# EAGLE design emrom (EAGLE 5.10)
COPYRIGHT: 202|238|226|224|240; DESCRIPTION_1: 209|245|229|236|224|32|253|235|229|234|242|240|232|247|229|241|234|224|255; DESCRIPTION_2: 239|240|232|237|232|246|232|239|232|224|235|252|237|224|255; DESCRIPTION_3: 253|236|243|235|255|242|238|240|224|32|207|199|211; NUMBER: 213|213|213|46|48|48|48|46|48|48|48|46|48|48|48
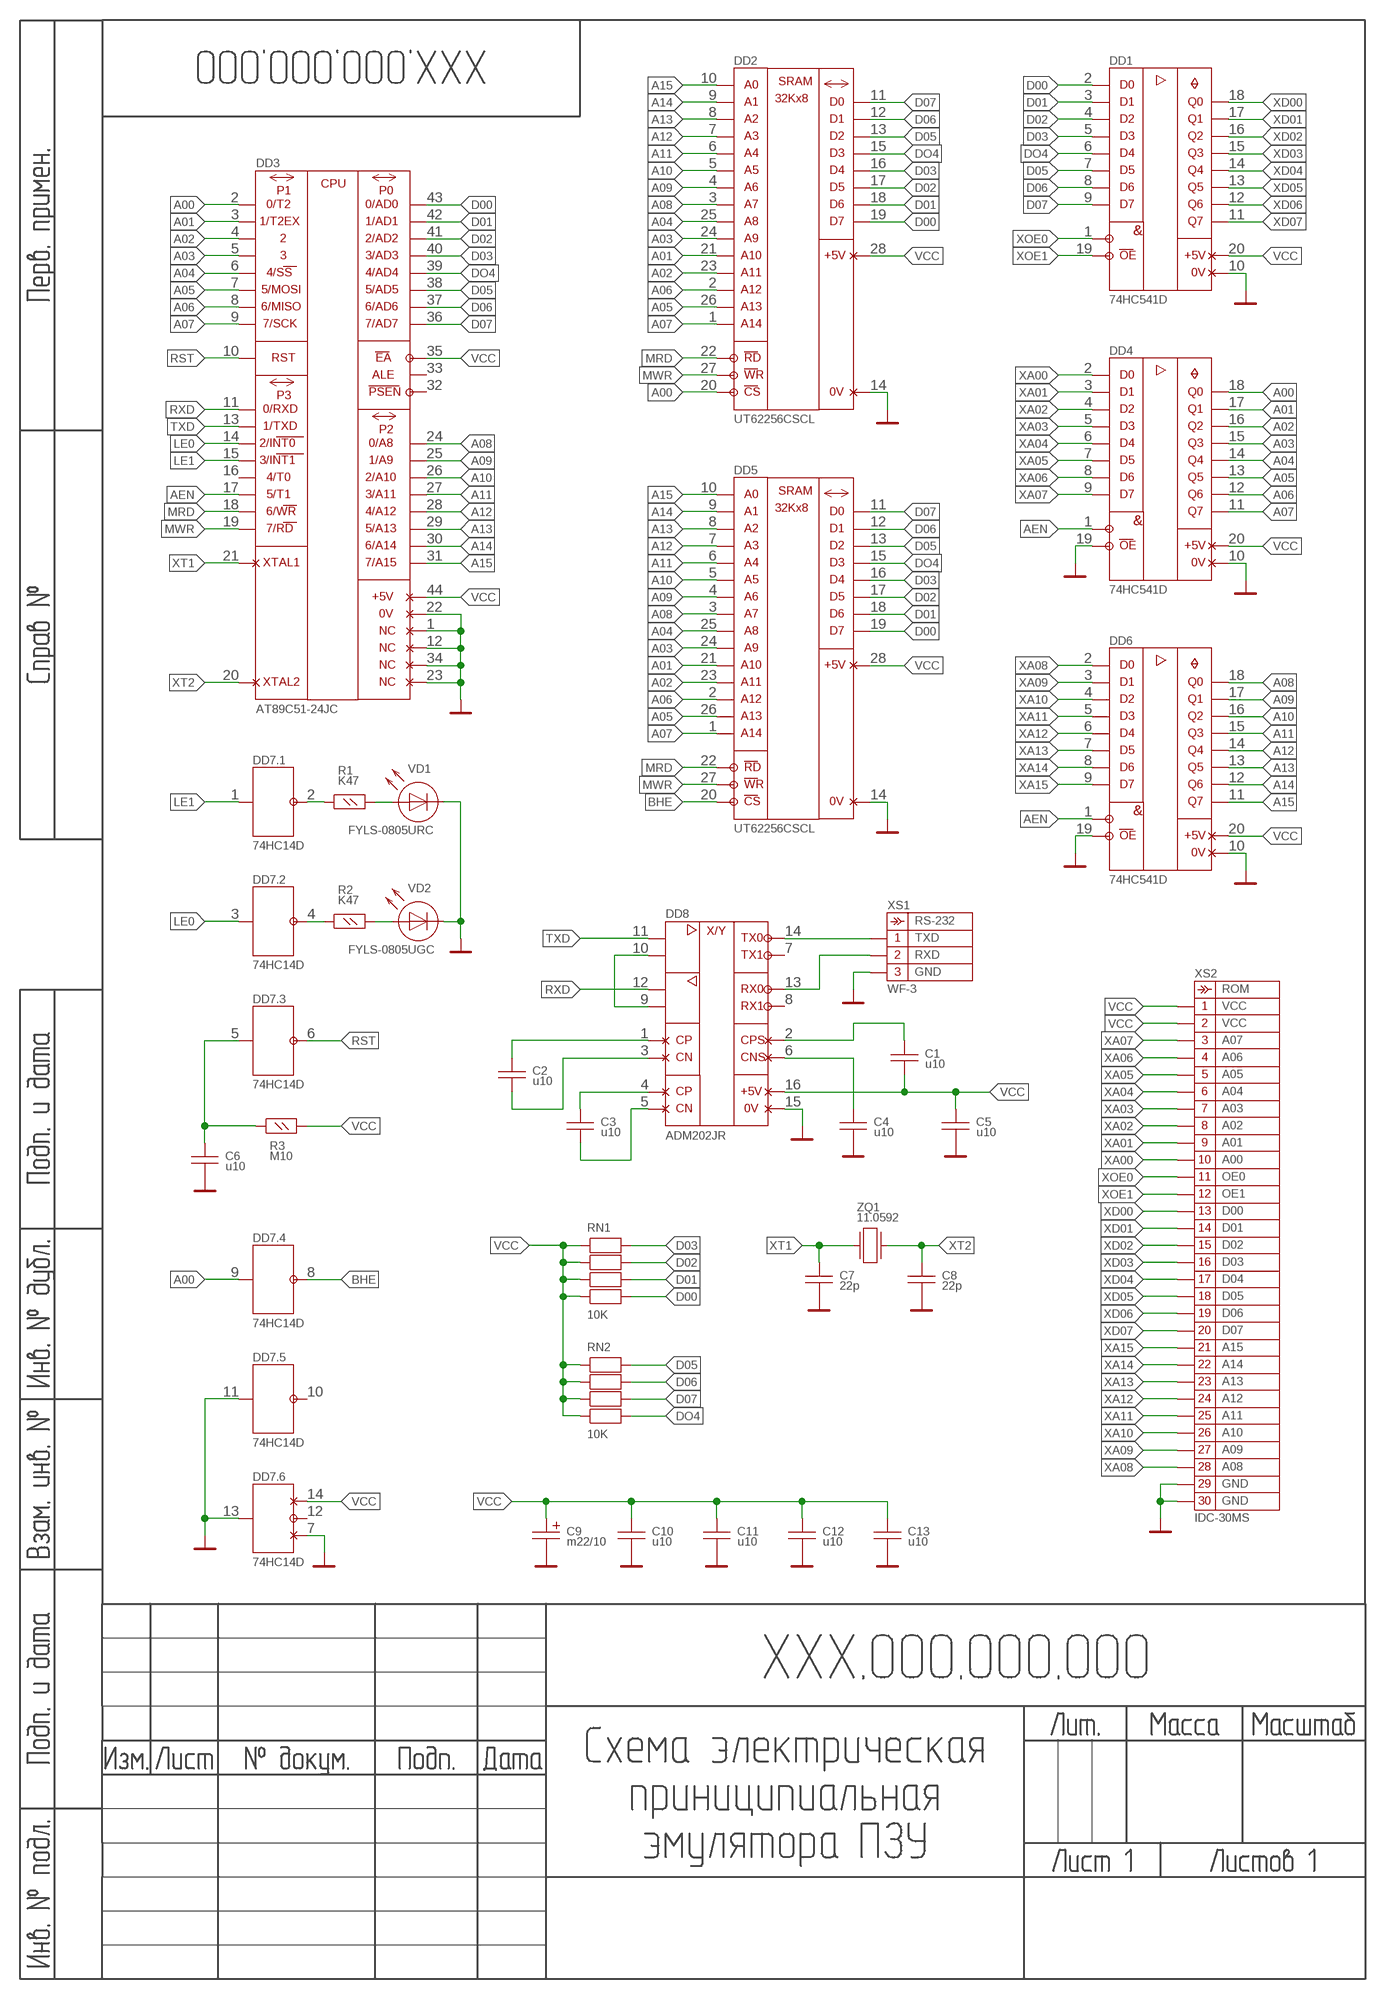
[diagram p0: schematic, sheet 1]

## Parts
C1  u10  CAPACITOR/GENERIC-0805  [GENERIC/0805]
C2  u10  CAPACITOR/GENERIC-0805  [GENERIC/0805]
C3  u10  CAPACITOR/GENERIC-0805  [GENERIC/0805]
C4  u10  CAPACITOR/GENERIC-0805  [GENERIC/0805]
C5  u10  CAPACITOR/GENERIC-0805  [GENERIC/0805]
C6  u10  CAPACITOR/GENERIC-0805  [GENERIC/0805]
C7  22p  CAPACITOR/GENERIC-0805  [GENERIC/0805]
C8  22p  CAPACITOR/GENERIC-0805  [GENERIC/0805]
C9  m22/10  CAPACITOR/POLAR-AXIAL:22-6  [CAPACITOR/AXIAL/E22-6]
C10  u10  CAPACITOR/GENERIC-0805  [GENERIC/0805]
C11  u10  CAPACITOR/GENERIC-0805  [GENERIC/0805]
C12  u10  CAPACITOR/GENERIC-0805  [GENERIC/0805]
C13  u10  CAPACITOR/GENERIC-0805  [GENERIC/0805]
DD1  74HC541D  DIGITAL/74HC541-SO20  [SO20W]
DD2  UT62256CSCL  DIGITAL/62C256-SOP28  [SOP28]
DD3  AT89C51-24JC  DIGITAL/AT89S51-PLCC44  [PLCC44]
DD4  74HC541D  DIGITAL/74HC541-SO20  [SO20W]
DD5  UT62256CSCL  DIGITAL/62C256-SOP28  [SOP28]
DD6  74HC541D  DIGITAL/74HC541-SO20  [SO20W]
DD7  74HC14D  DIGITAL/74HC04-SO14  [SO14]
DD8  ADM202JR  DIGITAL/MAX202-SO16  [SO16]
R1  K47  RESISTOR/0.125-0805  [GENERIC/0805]
R2  K47  RESISTOR/0.125-0805  [GENERIC/0805]
R3  M10  RESISTOR/0.125-0805  [GENERIC/0805]
RN1  10K  RESISTOR/SET/4  [GENERIC/1206/SET/4]
RN2  10K  RESISTOR/SET/4  [GENERIC/1206/SET/4]
VD1  FYLS-0805URC  DIODE/LED-0805  [GENERIC/0805]
VD2  FYLS-0805UGC  DIODE/LED-0805  [GENERIC/0805]
XS1  WF-3  CONNECTOR/3-WF  [CONNECTOR/3/WF]
XS2  IDC-30MS  CONNECTOR/30-IDC  [CONNECTOR/30/IDC]
ZQ1  11.0592  QUARTZ/GENERIC-49:PLANAR  [QUARTZ/49/SMD]

## Nets
0V: C4.2 C5.2 C6.2 C7.2 C8.2 C9.- C10.2 C11.2 C12.2 C13.2 DD1.10(GND) DD2.14(GND) DD3.1(NC0) DD3.12(NC1) DD3.22(GND) DD3.23(NC2) DD3.34(NC3) DD4.10(GND) DD4.19(DIR) DD5.14(GND) DD6.10(GND) DD6.19(DIR) DD7.7(P:0V) DD7.11(.5:A) DD7.13(.6:A) DD8.15(0V) VD1.2(CATHODE) VD2.2(CATHODE) XS1.3 XS2.29 XS2.30
A00: DD2.20(CS) DD3.2(P1.0) DD4.18(B0) DD7.9(.4:A)
A01: DD2.21(A10) DD3.3(P1.1) DD4.17(B1) DD5.21(A10)
A02: DD2.23(A11) DD3.4(P1.2) DD4.16(B2) DD5.23(A11)
A03: DD2.24(A9) DD3.5(P1.3) DD4.15(B3) DD5.24(A9)
A04: DD2.25(A8) DD3.6(P1.4) DD4.14(B4) DD5.25(A8)
A05: DD2.26(A13) DD3.7(P1.5) DD4.13(B5) DD5.26(A13)
A06: DD2.2(A12) DD3.8(P1.6) DD4.12(B6) DD5.2(A12)
A07: DD2.1(A14) DD3.9(P1.7) DD4.11(B7) DD5.1(A14)
A08: DD2.3(A7) DD3.24(P2.0) DD5.3(A7) DD6.18(B0)
A09: DD2.4(A6) DD3.25(P2.1) DD5.4(A6) DD6.17(B1)
A10: DD2.5(A5) DD3.26(P2.2) DD5.5(A5) DD6.16(B2)
A11: DD2.6(A4) DD3.27(P2.3) DD5.6(A4) DD6.15(B3)
A12: DD2.7(A3) DD3.28(P2.4) DD5.7(A3) DD6.14(B4)
A13: DD2.8(A2) DD3.29(P2.5) DD5.8(A2) DD6.13(B5)
A14: DD2.9(A1) DD3.30(P2.6) DD5.9(A1) DD6.12(B6)
A15: DD2.10(A0) DD3.31(P2.7) DD5.10(A0) DD6.11(B7)
AEN: DD3.17(P3.5) DD4.1(OE) DD6.1(OE)
BHE: DD5.20(CS) DD7.8(.4:Y)
D00: DD1.2(A0) DD2.19(D7) DD3.43(P0.0) DD5.19(D7) RN1.5(B4)
D01: DD1.3(A1) DD2.18(D6) DD3.42(P0.1) DD5.18(D6) RN1.6(B3)
D02: DD1.4(A2) DD2.17(D5) DD3.41(P0.2) DD5.17(D5) RN1.7(B2)
D03: DD1.5(A3) DD2.16(D4) DD3.40(P0.3) DD5.16(D4) RN1.8(B1)
D05: DD1.7(A5) DD2.13(D2) DD3.38(P0.5) DD5.13(D2) RN2.8(B1)
D06: DD1.8(A6) DD2.12(D1) DD3.37(P0.6) DD5.12(D1) RN2.7(B2)
D07: DD1.9(A7) DD2.11(D0) DD3.36(P0.7) DD5.11(D0) RN2.6(B3)
DO4: DD1.6(A4) DD2.15(D3) DD3.39(P0.4) DD5.15(D3) RN2.5(B4)
LE0: DD3.14(P3.2) DD7.3(.2:A)
LE1: DD3.15(P3.3) DD7.1(.1:A)
MRD: DD2.22(RD) DD3.18(P3.6) DD5.22(RD)
MWR: DD2.27(WR) DD3.19(P3.7) DD5.27(WR)
N$1: C3.1 DD8.4(C2P)
N$2: C4.1 DD8.6(VM)
N$3: C2.1 DD8.1(C1P)
N$4: C2.2 DD8.3(C1M)
N$6: C3.2 DD8.5(C2M)
N$7: C1.1 DD8.2(VP)
N$8: DD8.9(R2OUT) DD8.10(T2IN)
N$9: DD8.14(T1OUT) XS1.1
N$10: DD8.13(R1IN) XS1.2
N$11: DD7.4(.2:Y) R2.1
N$12: R2.2 VD2.1(ANODE)
N$13: R1.2 VD1.1(ANODE)
N$14: DD7.2(.1:Y) R1.1
N$15: C6.1 DD7.5(.3:A) R3.1
RST: DD3.10(RST) DD7.6(.3:Y)
RXD: DD3.11(P3.0) DD8.12(R1OUT)
TXD: DD3.13(P3.1) DD8.11(T1IN)
VCC: C1.2 C5.1 C9.+ C10.1 C11.1 C12.1 C13.1 DD1.20(VCC) DD2.28(VCC) DD3.35(EA) DD3.44(VCC) DD4.20(VCC) DD5.28(VCC) DD6.20(VCC) DD7.14(P:+U) DD8.16(VCC) R3.2 RN1.1(A1) RN1.2(A2) RN1.3(A3) RN1.4(A4) RN2.1(A1) RN2.2(A2) RN2.3(A3) RN2.4(A4) XS2.1 XS2.2
XA00: DD4.2(A0) XS2.10
XA01: DD4.3(A1) XS2.9
XA02: DD4.4(A2) XS2.8
XA03: DD4.5(A3) XS2.7
XA04: DD4.6(A4) XS2.6
XA05: DD4.7(A5) XS2.5
XA06: DD4.8(A6) XS2.4
XA07: DD4.9(A7) XS2.3
XA08: DD6.2(A0) XS2.28
XA09: DD6.3(A1) XS2.27
XA10: DD6.4(A2) XS2.26
XA11: DD6.5(A3) XS2.25
XA12: DD6.6(A4) XS2.24
XA13: DD6.7(A5) XS2.23
XA14: DD6.8(A6) XS2.22
XA15: DD6.9(A7) XS2.21
XD00: DD1.18(B0) XS2.13
XD01: DD1.17(B1) XS2.14
XD02: DD1.16(B2) XS2.15
XD03: DD1.15(B3) XS2.16
XD04: DD1.14(B4) XS2.17
XD05: DD1.13(B5) XS2.18
XD06: DD1.12(B6) XS2.19
XD07: DD1.11(B7) XS2.20
XOE0: DD1.1(OE) XS2.11
XOE1: DD1.19(DIR) XS2.12
XT1: C7.1 DD3.21(XTAL1) ZQ1.1
XT2: C8.1 DD3.20(XTAL2) ZQ1.2
Unconnected: DD3.16(P3.4) DD3.32(PSEN) DD3.33(ALE) DD7.10(.5:Y) DD7.12(.6:Y) DD8.7(T2OUT) DD8.8(R2IN)

## Notes on the sheet
- RS-232
- TXD
- RXD
- GND
- ROM
- VCC
- VCC
- A07
- A06
- A05
- A04
- A03
- A02
- A01
- A00
- OE0
- OE1
- D00
- D01
- D02
- D03
- D04
- D05
- D06
- D07
- A15
- A14
- A13
- A12
- A11
- A10
- A09
- A08
- GND
- GND

## Library data of the parts
C1-C8 C10-C13 = library:CAPACITOR/GENERIC
C9 = library:CAPACITOR/POLAR
DD1 DD4 DD6 = library:DIGITAL/74HC541: 74ALS, 74HC, 74AC ... series.
DD2 DD5 = library:DIGITAL/62C256: 62C256 SRAM series.
DD3 = library:DIGITAL/AT89S51: AT89S51 Intel 8051 compatible series with ICSP.
DD7 = library:DIGITAL/74HC04: 74ALS, 74HC, 74AC ... series.
DD8 = library:DIGITAL/MAX202: MAX202, MAX220, MAX232 ... RS-232 driver series.
R1-R3 = library:RESISTOR/0.125
RN1 RN2 = library:RESISTOR/SET/4
VD1 VD2 = library:DIODE/LED
XS1 = library:CONNECTOR/3
XS2 = library:CONNECTOR/30
ZQ1 = library:QUARTZ/GENERIC

## Board
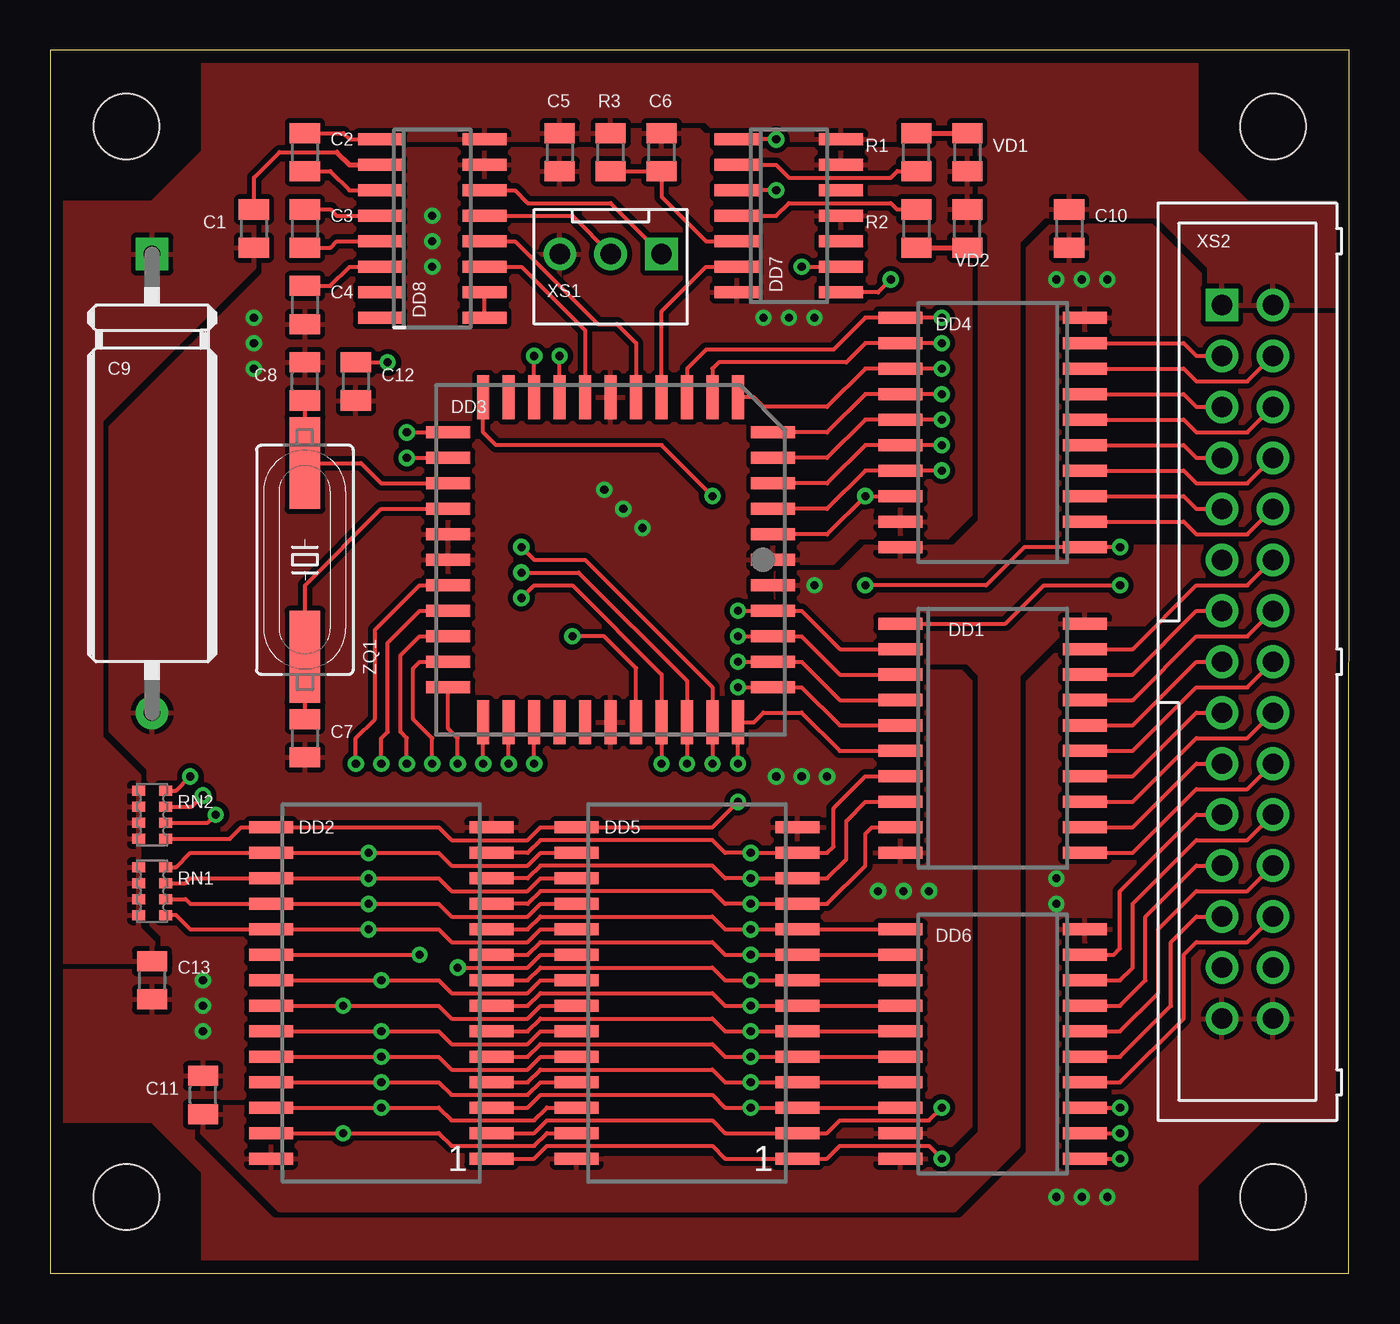
[diagram p1: board, top side]
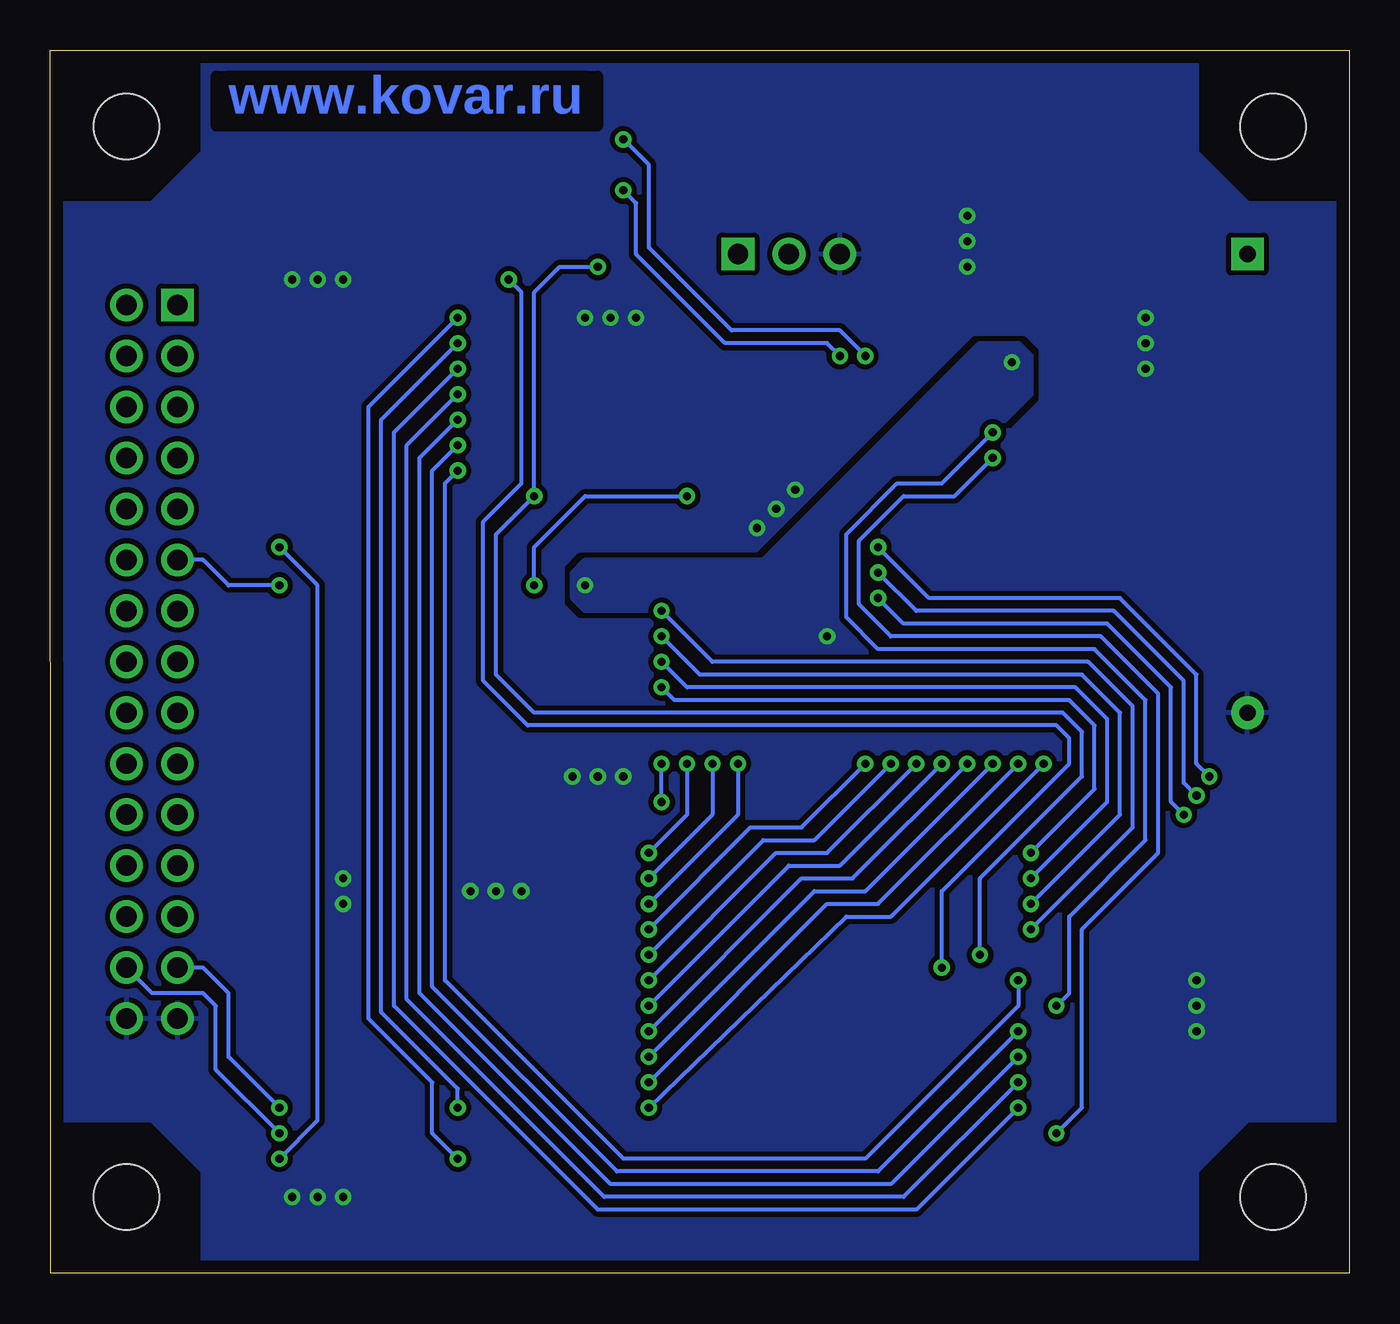
[diagram p2: board, bottom side, seen from below]

Size 64.77 x 60.96 mm. Coordinates in mm from the lower left corner, seen from the top.
Outline: 0,0 64.75,0 64.77,60.96 0,60.96 0,0
Copper layers (1*16): Top 0.035mm / dielectric 1.5mm / Bottom 0.035mm
Design rules "default *": minimum track width 8mil, minimum drill 16mil, track to track 8mil, track to pad 8mil, pad to pad 8mil, via to via 8mil, smd to smd 8mil, copper to edge 25mil, drill to drill 8mil, minimum pad ring 10mil, minimum via ring 8mil, stop-mask expansion 4mil, vias tented up to drill 16mil, thermal gap 10mil
Holes 3.25 mm at 60.96,57.15 60.96,3.81 3.81,57.15 3.81,3.81
bRestrict: area 37.5,57.2 to 56.5,59.7

### Footprints (pad centres in the part's own frame; a part is rotated, then mirrored left to right if it is on the bottom)
GENERIC/0805 = smd 1 x 1.5: 1 -0.95,0; 2 0.95,0
CAPACITOR/AXIAL/E22-6 = drill 0.813 pad 1.626 square: + -11.43,0 | drill 0.813 pad 1.626 round: - 11.43,0
SO20W = smd 0.6 x 2.2: 1 -5.715,-4.6; 2 -4.445,-4.6; 3 -3.175,-4.6; 4 -1.905,-4.6; 5 -0.635,-4.6; 6 0.635,-4.6; 7 1.905,-4.6; 8 3.175,-4.6; 9 4.445,-4.6; 10 5.715,-4.6; 11 5.715,4.6; 12 4.445,4.6; 13 3.175,4.6; 14 1.905,4.6; 15 0.635,4.6; 16 -0.635,4.6; 17 -1.905,4.6; 18 -3.175,4.6; 19 -4.445,4.6; 20 -5.715,4.6
SOP28 = smd 0.6 x 2.2: 1 -8.255,-5.5; 2 -6.985,-5.5; 3 -5.715,-5.5; 4 -4.445,-5.5; 5 -3.175,-5.5; 6 -1.905,-5.5; 7 -0.635,-5.5; 8 0.635,-5.5; 9 1.905,-5.5; 10 3.175,-5.5; 11 4.445,-5.5; 12 5.715,-5.5; 13 6.985,-5.5; 14 8.255,-5.5; 15 8.255,5.5; 16 6.985,5.5; 17 5.715,5.5; 18 4.445,5.5; 19 3.175,5.5; 20 1.905,5.5; 21 0.635,5.5; 22 -0.635,5.5; 23 -1.905,5.5; 24 -3.175,5.5; 25 -4.445,5.5; 26 -5.715,5.5; 27 -6.985,5.5; 28 -8.255,5.5
PLCC44 = smd 0.6 x 2.2: 1 0,8.1; 2 -1.27,8.1; 3 -2.54,8.1; 4 -3.81,8.1; 5 -5.08,8.1; 6 -6.35,8.1; 18 -6.35,-8.1; 19 -5.08,-8.1; 20 -3.81,-8.1; 21 -2.54,-8.1; 22 -1.27,-8.1; 23 0,-8.1; 24 1.27,-8.1; 25 2.54,-8.1; 26 3.81,-8.1; 27 5.08,-8.1; 28 6.35,-8.1; 40 6.35,8.1; 41 5.08,8.1; 42 3.81,8.1; 43 2.54,8.1; 44 1.27,8.1 | smd 2.2 x 0.6: 7 -8.1,6.35; 8 -8.1,5.08; 9 -8.1,3.81; 10 -8.1,2.54; 11 -8.1,1.27; 12 -8.1,0; 13 -8.1,-1.27; 14 -8.1,-2.54; 15 -8.1,-3.81; 16 -8.1,-5.08; 17 -8.1,-6.35; 29 8.1,-6.35; 30 8.1,-5.08; 31 8.1,-3.81; 32 8.1,-2.54; 33 8.1,-1.27; 34 8.1,0; 35 8.1,1.27; 36 8.1,2.54; 37 8.1,3.81; 38 8.1,5.08; 39 8.1,6.35
SO14 = smd 0.6 x 2.2: 1 -3.81,-2.6; 2 -2.54,-2.6; 3 -1.27,-2.6; 4 0,-2.6; 5 1.27,-2.6; 6 2.54,-2.6; 7 3.81,-2.6; 8 3.81,2.6; 9 2.54,2.6; 10 1.27,2.6; 11 0,2.6; 12 -1.27,2.6; 13 -2.54,2.6; 14 -3.81,2.6
SO16 = smd 0.6 x 2.2: 1 -4.445,-2.6; 2 -3.175,-2.6; 3 -1.905,-2.6; 4 -0.635,-2.6; 5 0.635,-2.6; 6 1.905,-2.6; 7 3.175,-2.6; 8 4.445,-2.6; 9 4.445,2.6; 10 3.175,2.6; 11 1.905,2.6; 12 0.635,2.6; 13 -0.635,2.6; 14 -1.905,2.6; 15 -3.175,2.6; 16 -4.445,2.6
GENERIC/1206/SET/4 = smd 0.5 x 0.65: 1 -1.2,-0.675; 2 -0.4,-0.675; 3 0.4,-0.675; 4 1.2,-0.675; 5 1.2,0.675; 6 0.4,0.675; 7 -0.4,0.675; 8 -1.2,0.675
CONNECTOR/3/WF = drill 1.016 pad 1.626 square: 1 -2.54,0 | drill 1.016 pad 1.626 round: 2 0,0; 3 2.54,0
CONNECTOR/30/IDC = drill 1.016 pad 1.626 square: 1 -17.78,-1.27 | drill 1.016 pad 1.626 round: 2 -17.78,1.27; 3 -15.24,-1.27; 4 -15.24,1.27; 5 -12.7,-1.27; 6 -12.7,1.27; 7 -10.16,-1.27; 8 -10.16,1.27; 9 -7.62,-1.27; 10 -7.62,1.27; 11 -5.08,-1.27; 12 -5.08,1.27; 13 -2.54,-1.27; 14 -2.54,1.27; 15 0,-1.27; 16 0,1.27; 17 2.54,-1.27; 18 2.54,1.27; 19 5.08,-1.27; 20 5.08,1.27; 21 7.62,-1.27; 22 7.62,1.27; 23 10.16,-1.27; 24 10.16,1.27; 25 12.7,-1.27; 26 12.7,1.27; 27 15.24,-1.27; 28 15.24,1.27; 29 17.78,-1.27; 30 17.78,1.27
QUARTZ/49/SMD = smd 4.572 x 1.524: 1 -4.826,0; 2 4.826,0

### Placement (x,y rotation side)
C1  10.16,52.07 270 top
C2  12.7,55.88 270 top
C3  12.7,52.07 270 top
C4  12.7,48.26 270 top
C5  25.4,55.88 270 top
C6  30.48,55.88 90 top
C7  12.7,26.67 270 top
C8  12.7,44.45 90 top
C9  5.08,39.37 270 top
C10  50.8,52.07 270 top
C11  7.62,8.89 90 top
C12  15.24,44.45 270 top
C13  5.08,14.61 270 top
DD1  46.99,26.67 270 top
DD2  16.51,13.97 90 top
DD3  27.94,35.56 270 top
DD4  46.99,41.91 90 top
DD5  31.75,13.97 90 top
DD6  46.99,11.43 90 top
DD7  36.83,52.7 270 top
DD8  19.05,52.07 270 top
R1  43.18,55.88 90 top
R2  43.18,52.07 270 top
R3  27.94,55.88 90 top
RN1  5.08,19.05 270 top
RN2  5.08,22.86 270 top
VD1  45.72,55.88 270 top
VD2  45.72,52.07 90 top
XS1  27.94,50.8 180 top
XS2  59.69,30.48 270 top
ZQ1  12.7,35.56 90 top

### Tracks (layer width: path | path; a pad name or v marks a point on that pad's centre or on a via)
0V  (via drill 0.41 pad 0.81)
  other vias: 43.81,19.05 42.55,19.05 41.27,19.05 38.73,24.77 37.47,24.77 36.2,24.77 50.16,19.68 50.16,18.41 50.16,49.53 51.44,49.53 52.7,49.53 7.62,12.06 7.62,13.34 7.62,14.61 10.16,47.62 10.16,46.35 10.16,45.09 36.83,47.62 35.56,47.62 38.1,47.62 19.05,51.44 19.05,52.7 19.05,50.16 28.57,38.1 27.62,39.05 29.53,37.15 51.44,3.81 50.16,3.81 52.7,3.81
  pour Top (isolate 0.254, rank 6): 0,7.62 5.08,7.62 7.62,5.08 7.62,0 57.15,0 57.15,4.45 60.33,7.62 64.77,7.62 64.77,53.34 59.69,53.34 57.15,55.88 57.15,60.96 7.62,60.96 7.62,55.88 5.08,53.34 0,53.34
  pour Bottom (isolate 0.254, rank 6): 0,7.62 5.08,7.62 7.62,5.08 7.62,0 57.15,0 57.15,5.08 59.69,7.62 64.77,7.62 64.77,53.34 59.69,53.34 57.15,55.88 57.15,60.96 7.62,60.96 7.62,55.88 5.08,53.34 0,53.34
A00  (via drill 0.41 pad 0.81)
  Top 0.203: DD3.2 38.73,36.83 v40.64,38.73 DD4.18 | DD2.20 v18.41,15.88 | v37.47,50.16 DD7.9
  Bottom 0.203: v18.41,15.88 18.41,19.68 13.34,24.77 13.34,26.99 14.29,27.94 40.64,27.94 42.55,29.84 42.55,36.83 v40.64,38.73 40.64,48.9 39.37,50.16 v37.47,50.16
A01  (via drill 0.41 pad 0.81)
  Top 0.203: DD5.21 24.45,14.61 23.81,13.97 20,13.97 19.37,14.61 v16.51,14.61 DD2.21 | v44.45,40.01 DD4.17 40.64,40.01 38.73,38.1 DD3.3
  Bottom 0.203: v44.45,40.01 45.09,39.37 45.09,14.61 36.2,5.71 24.13,5.71 16.51,13.34 v16.51,14.61
A02  (via drill 0.41 pad 0.81)
  Top 0.203: DD2.23 v16.51,12.06 19.37,12.06 20,11.43 23.81,11.43 24.45,12.06 DD5.23 | v44.45,41.27 DD4.16 40.64,41.27 38.73,39.37 DD3.4
  Bottom 0.203: v44.45,41.27 45.72,40.01 45.72,14.29 36.51,5.08 23.5,5.08 v16.51,12.06
A03  (via drill 0.41 pad 0.81)
  Top 0.203: DD5.24 24.45,10.79 23.81,10.16 20,10.16 19.37,10.79 v16.51,10.79 DD2.24 | v44.45,42.55 DD4.15 40.64,42.55 38.73,40.64 DD3.5
  Bottom 0.203: v44.45,42.55 46.35,40.64 46.35,13.97 36.83,4.45 22.86,4.45 v16.51,10.79
A04  (via drill 0.41 pad 0.81)
  Top 0.203: DD2.25 v16.51,9.53 19.37,9.53 20,8.89 23.81,8.89 24.45,9.53 DD5.25 | v44.45,43.81 DD4.14 40.64,43.81 38.73,41.91 DD3.6
  Bottom 0.203: v44.45,43.81 46.99,41.27 46.99,13.65 37.15,3.81 22.23,3.81 v16.51,9.53
A05  (via drill 0.41 pad 0.81)
  Top 0.203: DD5.26 24.77,8.26 24.13,7.62 20,7.62 19.37,8.26 v16.51,8.26 DD2.26 | v44.45,45.09 DD4.13 40.64,45.09 38.73,43.18 35.56,43.18 35.08,43.66 DD3.7
  Bottom 0.203: v44.45,45.09 47.62,41.91 47.62,13.34 37.47,3.17 21.59,3.17 v16.51,8.26
A06  (via drill 0.41 pad 0.81)
  Top 0.203: v44.45,8.26 43.81,7.62 39.37,7.62 38.73,6.99 DD5.2 33.66,6.99 33.02,7.62 24.77,7.62 24.13,6.99 DD2.2 | v44.45,46.35 DD4.12 40.64,46.35 39.69,45.4 33.34,45.4 33.02,45.09 DD3.8
  Bottom 0.203: v44.45,46.35 48.26,42.55 48.26,13.02 44.45,9.21 v44.45,8.26
A07  (via drill 0.41 pad 0.81)
  Top 0.203: v44.45,5.71 43.81,6.35 39.37,6.35 38.73,5.71 DD5.1 33.66,5.71 33.02,6.35 24.77,6.35 24.13,5.71 DD2.1 | v44.45,47.62 DD4.11 40.64,47.62 39.05,46.04 32.7,46.04 31.75,45.09 DD3.9
  Bottom 0.203: v44.45,47.62 48.9,43.18 48.9,12.7 45.72,9.53 45.72,6.99 v44.45,5.71
A08  (via drill 0.41 pad 0.81)
  Top 0.203: DD6.18 DD5.3 v34.92,8.26 33.66,8.26 33.02,8.89 24.45,8.89 23.81,8.26 DD2.3 | DD3.24 18.41,34.29 16.19,32.07 16.19,27.62 15.24,26.67 v15.24,25.4
  Bottom 0.203: v15.24,25.4 22.86,17.78 25.08,17.78 v34.92,8.26
A09  (via drill 0.41 pad 0.81)
  Top 0.203: DD6.17 DD5.4 v34.92,9.53 33.66,9.53 33.02,10.16 24.45,10.16 23.81,9.53 DD2.4 | DD3.25 18.41,33.02 16.83,31.43 16.83,26.99 16.51,26.67 v16.51,25.4
  Bottom 0.203: v16.51,25.4 23.5,18.41 26.04,18.41 v34.92,9.53
A10  (via drill 0.41 pad 0.81)
  Top 0.203: DD6.16 DD5.5 v34.92,10.79 33.66,10.79 33.02,11.43 24.45,11.43 23.81,10.79 DD2.5 | DD3.26 18.41,31.75 17.46,30.8 17.46,26.99 17.78,26.67 v17.78,25.4
  Bottom 0.203: v17.78,25.4 24.13,19.05 26.67,19.05 v34.92,10.79
A11  (via drill 0.41 pad 0.81)
  Top 0.203: DD6.15 DD5.6 v34.92,12.06 33.66,12.06 33.02,12.7 24.45,12.7 23.81,12.06 DD2.6 | DD3.27 18.41,30.48 18.1,30.16 18.1,27.62 19.05,26.67 v19.05,25.4
  Bottom 0.203: v19.05,25.4 24.77,19.68 27.3,19.68 v34.92,12.06
A12  (via drill 0.41 pad 0.81)
  Top 0.203: DD6.14 DD5.7 v34.92,13.34 33.66,13.34 33.02,13.97 24.45,13.97 23.81,13.34 DD2.7 | DD3.28 19.84,27.15 20.32,26.67 v20.32,25.4
  Bottom 0.203: v20.32,25.4 25.4,20.32 27.94,20.32 v34.92,13.34
A13  (via drill 0.41 pad 0.81)
  Top 0.203: DD6.13 DD5.8 v34.92,14.61 33.66,14.61 33.02,15.24 24.45,15.24 23.81,14.61 DD2.8 | v21.59,25.4 DD3.29
  Bottom 0.203: v21.59,25.4 26.04,20.95 28.57,20.95 v34.92,14.61
A14  (via drill 0.41 pad 0.81)
  Top 0.203: DD6.12 DD5.9 v34.92,15.88 33.66,15.88 33.02,16.51 24.45,16.51 23.81,15.88 DD2.9 | v22.86,25.4 DD3.30
  Bottom 0.203: v22.86,25.4 26.67,21.59 29.21,21.59 v34.92,15.88
A15  (via drill 0.41 pad 0.81)
  Top 0.203: DD6.11 DD5.10 v34.92,17.14 33.66,17.14 33.02,17.78 24.45,17.78 23.81,17.14 DD2.10 | v24.13,25.4 DD3.31
  Bottom 0.203: v24.13,25.4 27.3,22.23 29.84,22.23 v34.92,17.14
AEN  (via drill 0.41 pad 0.41, 0.41 pad 0.81)
  Top 0.203: DD6.1 v53.34,5.71 | v53.34,36.2 DD4.1 48.58,36.2 46.67,34.29 v40.64,34.29 | DD3.17 21.59,41.91 22.23,41.27 30.48,41.27 v33.02,38.73
  Bottom 0.203: v53.34,5.71 51.44,7.62 51.44,34.29 v53.34,36.2 | v33.02,38.73 38.1,38.73 40.64,36.2 v40.64,34.29
BHE  (via drill 0.41 pad 0.81)
  Top 0.203: DD5.20 24.45,15.88 23.81,15.24 v20.32,15.24 | DD7.8 41.27,48.9 v41.91,49.53
  Bottom 0.203: v20.32,15.24 20.32,19.05 13.97,25.4 13.97,26.67 14.61,27.3 40.96,27.3 43.18,29.53 43.18,37.47 41.27,39.37 41.27,48.9 v41.91,49.53
D00  (via drill 0.41 pad 0.81)
  Top 0.203: DD1.2 39.37,31.11 37.47,33.02 DD3.43 v34.29,33.02 | DD5.19 24.45,17.14 23.81,16.51 20,16.51 19.37,17.14 v15.88,17.14 DD2.19 6.99,17.14 6.28,17.85 RN1.5
  Bottom 0.203: v34.29,33.02 31.75,30.48 13.02,30.48 10.79,28.26 10.79,22.23 v15.88,17.14
D01  (via drill 0.41 pad 0.81)
  Top 0.203: DD1.3 39.37,29.84 37.47,31.75 DD3.42 v34.29,31.75 | DD5.18 24.45,18.41 23.81,17.78 20,17.78 19.37,18.41 v15.88,18.41 DD2.18 6.99,18.41 6.75,18.65 RN1.6
  Bottom 0.203: v34.29,31.75 32.38,29.84 13.34,29.84 11.43,27.94 11.43,22.86 v15.88,18.41
D02  (via drill 0.41 pad 0.81)
  Top 0.203: DD1.4 39.37,28.57 37.47,30.48 DD3.41 v34.29,30.48 | DD5.17 24.45,19.68 23.81,19.05 20,19.05 19.37,19.68 v15.88,19.68 DD2.17 6.99,19.68 6.75,19.45 RN1.7
  Bottom 0.203: v34.29,30.48 33.02,29.21 13.65,29.21 12.06,27.62 12.06,23.5 v15.88,19.68
D03  (via drill 0.41 pad 0.81)
  Top 0.203: DD1.5 39.37,27.3 37.47,29.21 DD3.40 v34.29,29.21 | DD5.16 24.45,20.95 23.81,20.32 20,20.32 19.37,20.95 v15.88,20.95 DD2.16 6.99,20.95 6.28,20.25 RN1.8
  Bottom 0.203: v34.29,29.21 33.66,28.57 13.97,28.57 12.7,27.3 12.7,24.13 v15.88,20.95
D05  (via drill 0.41 pad 0.81)
  Top 0.203: DD2.13 23.81,20.95 24.45,21.59 33.02,21.59 33.66,20.95 v34.92,20.95 DD5.13 38.73,20.95 39.05,21.27 39.05,23.18 40.64,24.77 DD1.7 | v33.02,25.4 DD3.38 33.02,29.21 26.67,35.56 24.13,35.56 v23.5,36.2 | RN2.8 6.28,24.06 v6.99,24.77
  Bottom 0.203: v33.02,25.4 33.02,22.86 v34.92,20.95 | v6.99,24.77 7.62,25.4 7.62,29.84 11.43,33.66 20.95,33.66 v23.5,36.2
D06  (via drill 0.41 pad 0.81)
  Top 0.203: DD2.12 23.81,19.68 24.45,20.32 33.02,20.32 33.66,19.68 v34.92,19.68 DD5.12 38.73,19.68 39.69,20.64 39.69,22.54 40.64,23.5 DD1.8 | v31.75,25.4 DD3.37 31.75,29.53 26.35,34.92 v23.5,34.92 | RN2.7 7.07,23.26 v7.62,23.81
  Bottom 0.203: v31.75,25.4 31.75,22.86 v34.92,19.68 | v7.62,23.81 8.26,24.45 8.26,29.53 11.75,33.02 21.59,33.02 v23.5,34.92
D07  (via drill 0.41 pad 0.81)
  Top 0.203: DD2.11 23.81,18.41 24.45,19.05 33.02,19.05 33.66,18.41 v34.92,18.41 DD5.11 38.73,18.41 40.64,20.32 40.64,21.91 40.96,22.23 DD1.9 | v30.48,25.4 DD3.36 30.48,29.84 26.04,34.29 24.13,34.29 v23.5,33.66 | RN2.6 7.86,22.46 v8.26,22.86
  Bottom 0.203: v30.48,25.4 30.48,22.86 v34.92,18.41 | v8.26,22.86 8.89,23.5 8.89,29.21 12.06,32.38 22.23,32.38 v23.5,33.66
DO4  (via drill 0.41 pad 0.81)
  Top 0.203: v34.29,23.5 33.02,22.23 DD5.15 24.45,22.23 23.81,21.59 20,21.59 19.37,22.23 DD2.15 9.53,22.23 8.96,21.66 RN2.5 | DD1.6 39.37,26.04 37.47,27.94 35.56,27.94 35.08,27.46 DD3.39 v34.29,25.4
  Bottom 0.203: v34.29,23.5 v34.29,25.4
LE0  (via drill 0.41 pad 0.81)
  Top 0.203: DD3.14 v25.4,45.72 | v36.2,53.98 DD7.3
  Bottom 0.203: v25.4,45.72 26.04,46.35 31.11,46.35 35.56,50.8 35.56,53.34 v36.2,53.98
LE1  (via drill 0.41 pad 0.81)
  Top 0.203: DD3.15 v24.13,45.72 | v36.2,56.52 DD7.1
  Bottom 0.203: v24.13,45.72 25.4,46.99 30.8,46.99 34.92,51.12 34.92,55.24 v36.2,56.52
MRD  (via drill 0.41 pad 0.81)
  Top 0.203: DD5.22 24.45,13.34 23.81,12.7 20,12.7 19.37,13.34 v14.61,13.34 DD2.22 | v17.78,41.91 DD3.18
  Bottom 0.203: v17.78,41.91 20.32,39.37 22.54,39.37 25.08,36.83 25.08,32.7 23.5,31.11 12.7,31.11 10.16,28.57 10.16,21.59 13.97,17.78 13.97,13.97 v14.61,13.34
MWR  (via drill 0.41 pad 0.41, 0.41 pad 0.81)
  Top 0.203: DD5.27 24.77,6.99 24.13,6.35 20,6.35 19.37,6.99 v14.61,6.99 DD2.27 | v17.78,40.64 DD3.19
  Bottom 0.203: v17.78,40.64 19.68,38.73 22.23,38.73 24.45,36.51 24.45,33.34 22.86,31.75 12.38,31.75 9.53,28.89 9.53,20.95 13.34,17.14 13.34,8.26 v14.61,6.99
N$1
  Top 0.203: C3.1 13.97,53.02 14.29,52.7 DD8.4
N$2
  Top 0.203: C4.1 13.97,49.21 14.92,50.16 DD8.6
N$3
  Top 0.203: C2.1 14.61,56.83 14.92,56.52 DD8.1
N$4
  Top 0.203: C2.2 13.97,54.93 14.92,53.98 DD8.3
N$6
  Top 0.203: C3.2 13.97,51.12 14.29,51.44 DD8.5
N$7
  Top 0.203: C1.1 10.16,54.61 11.43,55.88 14.29,55.88
  Top 0.254: DD8.2 14.92,55.24 14.29,55.88
N$8
  Top 0.203: DD8.9 DD8.10
N$9
  Top 0.203: DD8.14 23.18,53.98 23.81,53.34 27.94,53.34 XS1.1
N$10
  Top 0.203: DD8.13 26.04,52.7 XS1.2
N$11
  Top 0.203: DD7.4 36.2,52.7 36.83,53.34 41.91,53.34 42.23,53.02 R2.1
N$12
  Top 0.254: R2.2 VD2.1
N$13
  Top 0.254: R1.2 VD1.1
N$14
  Top 0.203: DD7.2 36.2,55.24 36.83,54.61 41.91,54.61 42.23,54.93 R1.1
N$15
  Top 0.203: R3.1 C6.1 30.48,53.66 32.7,51.44 DD7.5
RST
  Top 0.203: DD3.10 30.48,47.94 32.7,50.16 DD7.6
RXD
  Top 0.203: DD8.12 23.18,51.44 27.3,47.31 28.26,47.31 29.21,46.35 DD3.11
TXD
  Top 0.203: DD3.13 26.67,46.99 23.5,50.16 DD8.11
VCC  (via drill 0.41 pad 0.81)
  Top 0.203: C12.1 v16.82,45.4 v16.83,45.4 | DD3.35 29.21,30.16 27.62,31.75 v26.04,31.75
  other vias: 38.1,34.29
  pour Top (isolate 0.254, rank 5): 11.43,3.17 45.09,3.17 48.26,6.35 48.26,29.84 50.8,32.38 58.42,32.38 58.42,36.2 48.26,36.2 48.26,51.44 49.53,52.7 55.24,52.7 57.78,50.16 57.78,48.26 64.77,48.26 64.77,53.34 59.69,53.34 57.15,55.88 57.15,60.96 7.62,60.96 7.62,55.88 5.08,53.34 0,53.34 0,15.56 5.71,15.56 5.71,15.88 4.45,17.14 4.45,24.77 2.54,26.67 2.54,42.55 10.16,50.16 10.16,54.61 12.06,56.52 28.57,56.52 28.57,57.47 32.7,57.47 33.66,56.52 46.35,56.52 46.35,37.47 45.09,36.2 40.64,36.2 39.37,34.92 36.2,34.92 36.2,33.66 36.83,33.66 40.01,30.48 45.72,30.48 46.35,29.84 46.35,6.99 45.09,5.71 22.23,5.71 19.68,8.26 6.99,8.26 6.99,7.62
  pour Bottom (isolate 0.254, rank 5): 38.73,33.66 38.73,34.92 38.1,35.56 29.21,35.56 18.41,46.35 16.51,46.35 15.88,45.72 15.88,43.81 17.78,41.91 17.78,40.64 19.68,38.73 22.23,38.73 24.13,36.83 23.5,36.2 23.5,30.48 31.75,30.48 34.29,33.02 38.1,33.02
XA00
  Top 0.203: DD4.2 56.52,37.47 57.15,36.83 59.69,36.83 XS2.10
XA01
  Top 0.203: DD4.3 56.52,38.73 57.15,38.1 XS2.9
XA02
  Top 0.203: DD4.4 56.52,40.01 57.15,39.37 59.69,39.37 XS2.8
XA03
  Top 0.203: DD4.5 56.52,41.27 57.15,40.64 XS2.7
XA04
  Top 0.203: DD4.6 56.52,42.55 57.15,41.91 59.69,41.91 XS2.6
XA05
  Top 0.203: DD4.7 56.52,43.81 57.15,43.18 XS2.5
XA06
  Top 0.203: DD4.8 56.52,45.09 57.15,44.45 59.69,44.45 XS2.4
XA07
  Top 0.203: DD4.9 56.52,46.35 57.15,45.72 XS2.3
XA08  (via drill 0.41 pad 0.81)
  Top 0.203: DD6.2 v53.34,6.99
  Bottom 0.203: v53.34,6.99 56.52,10.16 56.52,13.34 57.15,13.97 59.69,13.97 XS2.28
XA09  (via drill 0.41 pad 0.81)
  Top 0.203: DD6.3 v53.34,8.26
  Bottom 0.203: v53.34,8.26 55.88,10.79 55.88,13.97 57.15,15.24 XS2.27
XA10
  Top 0.203: DD6.4 53.34,9.53 56.52,12.7 56.52,15.88 57.15,16.51 59.69,16.51 XS2.26
XA11
  Top 0.203: DD6.5 53.34,10.79 55.88,13.34 55.88,16.51 57.15,17.78 XS2.25
XA12
  Top 0.203: DD6.6 53.34,12.06 55.24,13.97 55.24,17.14 57.15,19.05 59.69,19.05 XS2.24
XA13
  Top 0.203: DD6.7 53.34,13.34 54.61,14.61 54.61,17.78 57.15,20.32 XS2.23
XA14
  Top 0.203: DD6.8 53.34,14.61 53.98,15.24 53.98,18.41 57.15,21.59 59.69,21.59 XS2.22
XA15
  Top 0.203: DD6.9 53.02,15.88 53.34,16.19 53.34,19.05 57.15,22.86 XS2.21
XD00
  Top 0.203: DD1.18 53.98,29.84 57.15,33.02 XS2.13
XD01
  Top 0.203: DD1.17 53.98,28.57 57.15,31.75 59.69,31.75 XS2.14
XD02
  Top 0.203: DD1.16 53.98,27.3 57.15,30.48 XS2.15
XD03
  Top 0.203: DD1.15 53.98,26.04 57.15,29.21 59.69,29.21 XS2.16
XD04
  Top 0.203: DD1.14 53.98,24.77 57.15,27.94 XS2.17
XD05
  Top 0.203: DD1.13 53.98,23.5 57.15,26.67 59.69,26.67 XS2.18
XD06
  Top 0.203: DD1.12 53.98,22.23 57.15,25.4 XS2.19
XD07
  Top 0.203: DD1.11 53.98,20.95 57.15,24.13 59.69,24.13 XS2.20
XOE0  (via drill 0.41 pad 0.81)
  Top 0.203: DD1.1 47.62,32.38 49.53,34.29 v53.34,34.29
  Bottom 0.203: v53.34,34.29 55.88,34.29 57.15,35.56 XS2.11
XOE1
  Top 0.203: DD1.19 53.98,31.11 57.15,34.29 59.69,34.29 XS2.12
XT1
  Top 0.203: C7.1 ZQ1.1 12.7,34.29 16.51,38.1 DD3.21
XT2
  Top 0.203: C8.1 ZQ1.2 15.49,40.39 16.51,39.37 DD3.20

### Text on the board
Bottom: www.kovar.ru